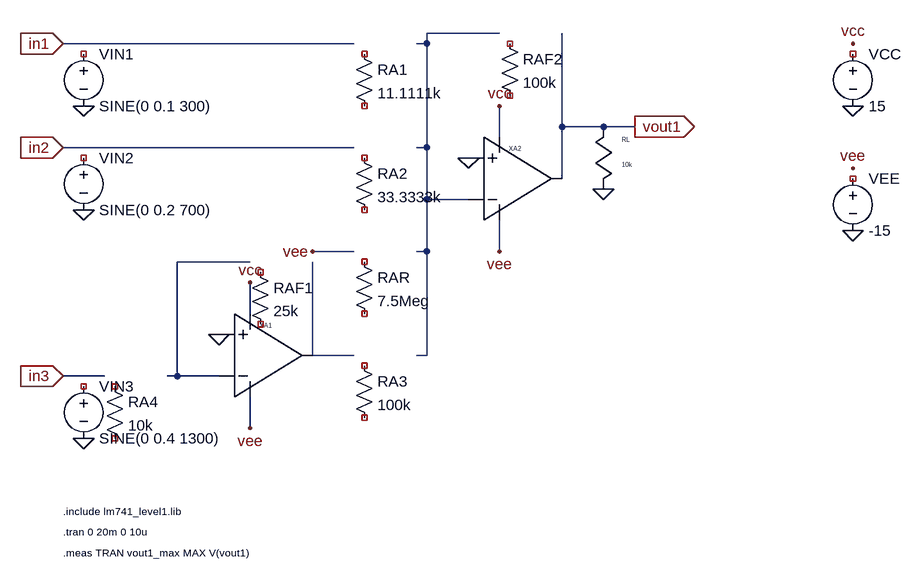
[diagram p0: schematic rs2_bloco_a.asc]
rs2_bloco_a.asc, the LTspice schematic file:
Version 4
SHEET 1 1541 1063
WIRE 608 96 624 96
WIRE 608 256 624 256
WIRE 608 416 624 416
WIRE 608 576 624 576
WIRE 624 80 624 576
WIRE 624 336 688 336
WIRE 736 240 736 192
WIRE 736 368 736 416
WIRE 624 80 736 80
WIRE 832 80 832 304
WIRE 224 608 240 608
WIRE 240 432 240 608
WIRE 240 608 304 608
WIRE 352 512 352 464
WIRE 352 640 352 688
WIRE 240 432 352 432
WIRE 448 432 448 576
WIRE 448 416 512 416
WIRE 448 576 512 576
WIRE 64 96 512 96
WIRE 64 256 512 256
WIRE 64 608 128 608
WIRE 832 224 944 224
SYMBOL res 512 96 R0
SYMATTR InstName RA1
SYMATTR Value 11.1111k
SYMBOL res 512 256 R0
SYMATTR InstName RA2
SYMATTR Value 33.3333k
SYMBOL res 512 416 R0
SYMATTR InstName RAR
SYMATTR Value 7.5Meg
SYMBOL res 512 576 R0
SYMATTR InstName RA3
SYMATTR Value 100k
SYMBOL opamp2 688 240 R0
SYMATTR InstName XA2
SYMATTR Value LM741_LEVEL1
SYMBOL res 736 80 R0
SYMATTR InstName RAF2
SYMATTR Value 100k
SYMBOL res 128 608 R0
SYMATTR InstName RA4
SYMATTR Value 10k
SYMBOL opamp2 304 512 R0
SYMATTR InstName XA1
SYMATTR Value LM741_LEVEL1
SYMBOL res 352 432 R0
SYMATTR InstName RAF1
SYMATTR Value 25k
SYMBOL voltage 96 96 R0
SYMATTR InstName VIN1
SYMATTR Value SINE(0 0.1 300)
SYMBOL voltage 96 256 R0
SYMATTR InstName VIN2
SYMATTR Value SINE(0 0.2 700)
SYMBOL voltage 96 608 R0
SYMATTR InstName VIN3
SYMATTR Value SINE(0 0.4 1300)
SYMBOL res_v 896 224 R0
SYMATTR InstName RL
SYMATTR Value 10k
SYMBOL voltage 1280 96 R0
SYMATTR InstName VCC
SYMATTR Value 15
SYMBOL voltage 1280 288 R0
SYMATTR InstName VEE
SYMATTR Value -15
FLAG 688 272 0
FLAG 736 192 vcc
FLAG 736 416 vee
FLAG 304 544 0
FLAG 352 464 vcc
FLAG 352 688 vee
FLAG 448 416 vee
FLAG 96 192 0
FLAG 64 96 in1
IOPIN 64 96 In
FLAG 96 352 0
FLAG 64 256 in2
IOPIN 64 256 In
FLAG 96 704 0
FLAG 64 608 in3
IOPIN 64 608 In
FLAG 896 320 0
FLAG 944 224 vout1
IOPIN 944 224 Out
FLAG 1280 96 vcc
FLAG 1280 192 0
FLAG 1280 288 vee
FLAG 1280 384 0
TEXT 64 816 Left 1 !.include lm741_level1.lib
TEXT 64 848 Left 1 !.tran 0 20m 0 10u
TEXT 64 880 Left 1 !.meas TRAN vout1_max MAX V(vout1)

The netlist it stands for:
* rs2_bloco_a.asc
RA1 NC_01 NC_02 11.1111k
RA2 NC_03 NC_04 33.3333k
RAR NC_05 NC_06 7.5Meg
RA3 NC_07 NC_08 100k
XXA2 CLAW_IDEAL_OPAMP LM741_LEVEL1
RAF2 NC_09 NC_10 100k
RA4 NC_11 NC_12 10k
XXA1 CLAW_IDEAL_OPAMP LM741_LEVEL1
RAF1 NC_13 NC_14 25k
VIN1 NC_15 0 SINE(0 0.1 300)
VIN2 NC_16 0 SINE(0 0.2 700)
VIN3 NC_17 0 SINE(0 0.4 1300)
RL vout1 0 10k
VCC NC_18 0 15
VEE NC_19 0 -15
.include lm741_level1.lib
.tran 0 20m 0 10u
.meas TRAN vout1_max MAX V(vout1)
.backanno
.end